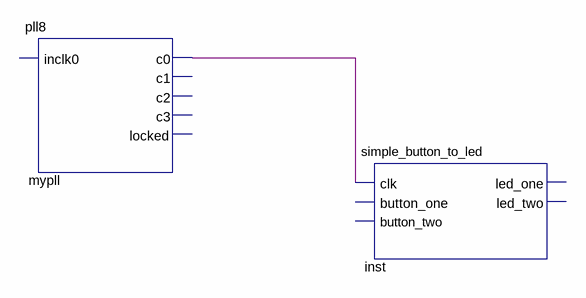
[diagram p0: schematic sheet]
// Quartus schematic simple_start.bdf as structural Verilog: 2 symbols, 0 pins
module simple_start (
);

  wire mypll_c0;

  pll8 mypll (.c0(mypll_c0));  // open: inclk0, c1, c2, c3, locked
  simple_button_to_led inst (.clk(mypll_c0));  // open: button_one, button_two, led_one, led_two
endmodule
